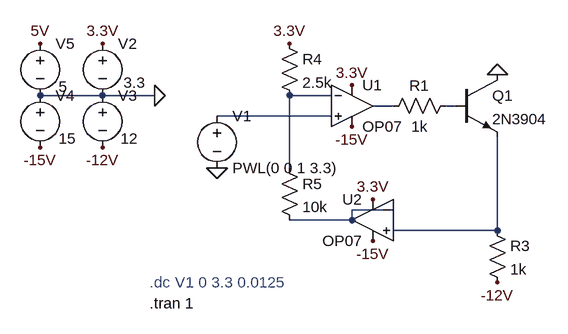
[diagram p0: schematic Analog-Test.asc]
Analog-Test.asc, the LTspice schematic file:
Version 4.1
SHEET 1 880 680
WIRE -192 128 -288 128
WIRE -112 128 -192 128
WIRE 160 128 96 128
WIRE 256 144 224 144
WIRE 352 144 336 144
WIRE 160 160 -16 160
WIRE 96 240 96 128
WIRE 256 304 192 304
WIRE 192 320 192 304
WIRE 192 320 96 320
WIRE 416 336 416 192
WIRE 416 336 256 336
FLAG 416 96 0
FLAG -112 128 0
FLAG -16 240 0
FLAG -192 208 -12V
FLAG -192 48 3.3V
FLAG 192 112 3.3V
FLAG 96 48 3.3V
FLAG 416 416 -12V
FLAG -288 208 -15V
FLAG -288 48 5V
FLAG 224 288 3.3V
FLAG 224 352 -15V
FLAG 192 176 -15V
SYMBOL npn 352 96 R0
SYMATTR InstName Q1
SYMATTR Value 2N3904
SYMBOL res 352 128 R90
WINDOW 0 0 56 VBottom 2
WINDOW 3 32 56 VTop 2
SYMATTR InstName R1
SYMATTR Value 1k
SYMBOL res 400 320 R0
SYMATTR InstName R3
SYMATTR Value 1k
SYMBOL res 80 32 R0
SYMATTR InstName R4
SYMATTR Value 2.5k
SYMBOL res 80 224 R0
SYMATTR InstName R5
SYMATTR Value 10k
SYMBOL voltage -16 144 R0
WINDOW 123 0 0 Left 0
WINDOW 39 0 0 Left 0
SYMATTR InstName V1
SYMATTR Value PWL(0 0 1 3.3)
SYMBOL voltage -192 32 R0
WINDOW 3 32 76 Left 2
WINDOW 123 0 0 Left 0
WINDOW 39 0 0 Left 0
SYMATTR InstName V2
SYMATTR Value 3.3
SYMBOL voltage -192 112 R0
WINDOW 3 28 82 Left 2
WINDOW 123 0 0 Left 0
WINDOW 39 0 0 Left 0
SYMATTR InstName V3
SYMATTR Value 12
SYMBOL voltage -288 112 R0
WINDOW 3 28 82 Left 2
WINDOW 123 0 0 Left 0
WINDOW 39 0 0 Left 0
SYMATTR InstName V4
SYMATTR Value 15
SYMBOL voltage -288 32 R0
WINDOW 3 28 82 Left 2
WINDOW 123 0 0 Left 0
WINDOW 39 0 0 Left 0
SYMATTR InstName V5
SYMATTR Value 5
SYMBOL OpAmps\\OP07 192 80 R0
SYMATTR InstName U1
SYMBOL OpAmps\\OP07 224 256 M0
SYMATTR InstName U2
TEXT -120 416 Left 2 ;.dc V1 0 3.3 0.0125
TEXT -120 448 Left 2 !.tran 1

The netlist it stands for:
* Analog-Test.asc
Q1 0 N003 N006 0 2N3904
R1 N003 N002 1k
R3 N006 -12V 1k
R4 3.3V N001 2.5k
R5 N001 N005 10k
V1 N004 0 PWL(0 0 1 3.3)
V2 3.3V 0 3.3
V3 0 -12V 12
V4 0 -15V 15
V5 5V 0 5
X§U1 N004 N001 3.3V -15V N002 LT1001  ; OP07, pins In+ In- V+ V- OUT
X§U2 N006 N005 3.3V -15V N005 LT1001  ; OP07, pins In+ In- V+ V- OUT
.model NPN NPN
.model PNP PNP
.lib standard.bjt
* .dc V1 0 3.3 0.0125
.tran 1
.lib LTC.lib
.backanno
.end